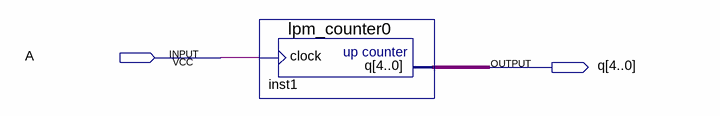
[diagram p0: schematic sheet]
// Quartus schematic lab3.bdf as structural Verilog: 1 symbols, 2 pins
module lab3 (
  input  A,
  output [4:0] q
);

  lpm_counter0 inst1 (.clock(A), .q(q));
endmodule
